# Altium schematic sheet User Interface.SchDoc
size A4; SheetNumber: 4; SheetTotal: 8
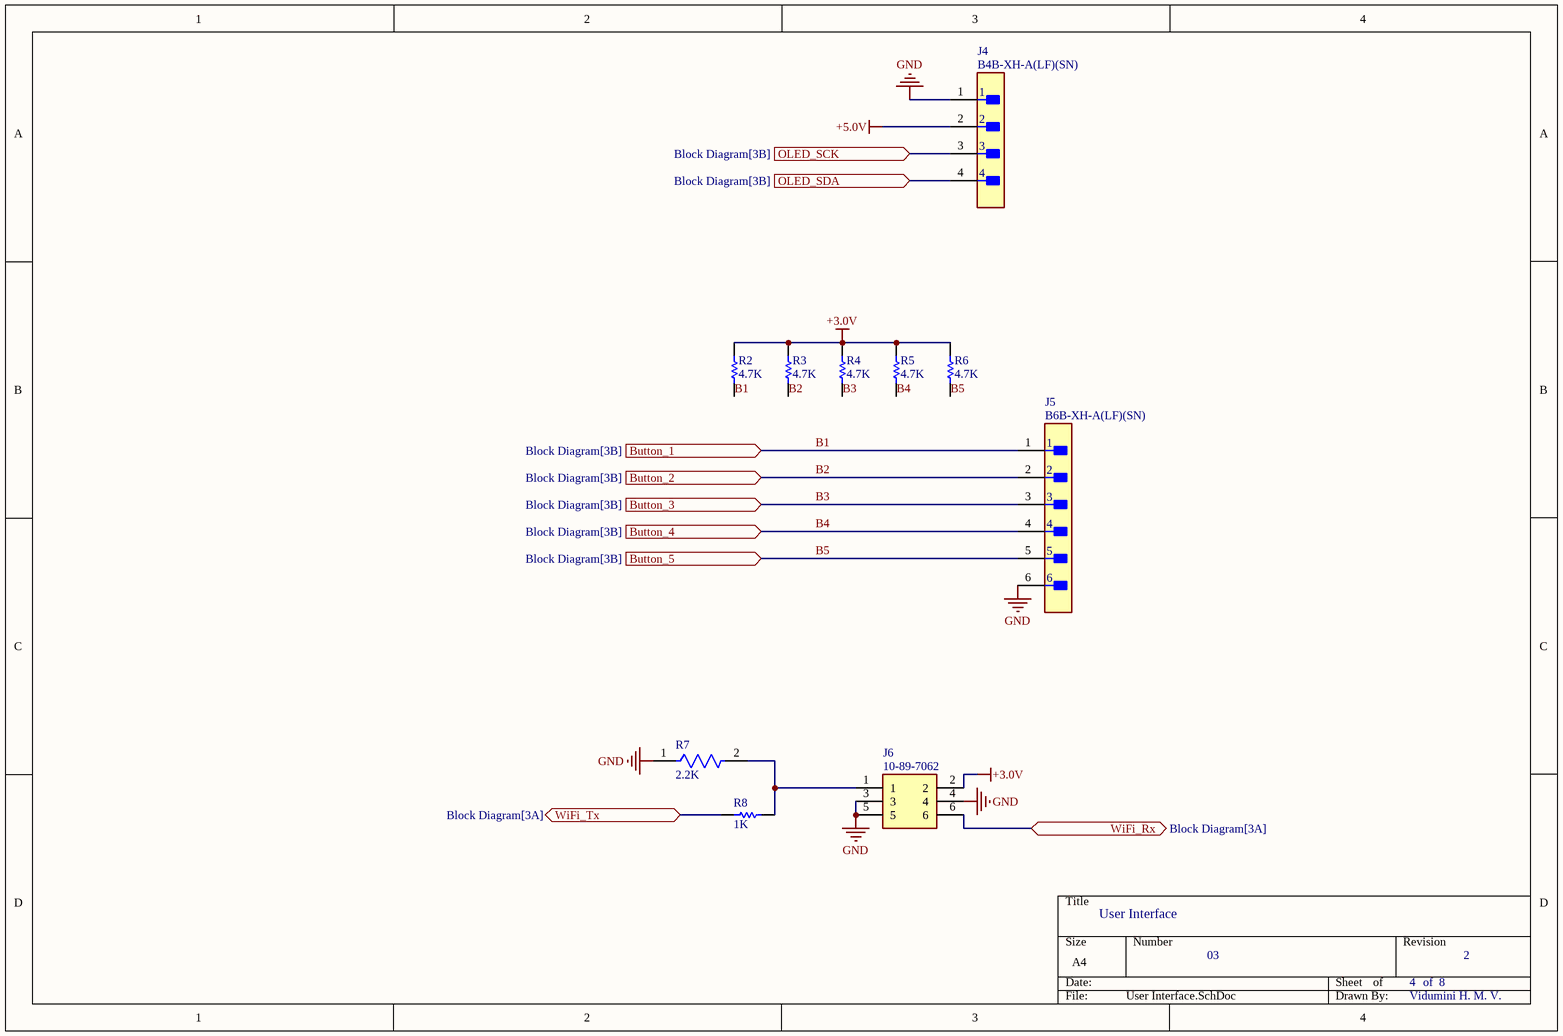
[diagram p0: User Interface.SchDoc]

## Parts
J4  B4B-XH-A(LF)(SN)  [FP-B4B-XH-A_LF_SN-MFG]
J5  B6B-XH-A(LF)(SN)  [FP-B6B-XH-A_LF_SN-MFG]
J6  10-89-7062  [HDRV6W87P254_2X3_775X508X864P]
R2  4.7K  [RESC3216X60X45ML15T20]
R3  4.7K  [RESC3216X60X45ML15T20]
R4  4.7K  [RESC3216X60X45ML15T20]
R5  4.7K  [RESC3216X60X45ML15T20]
R6  4.7K  [RESC3216X60X45ML15T20]
R7  2.2K  [FP-RT1206-MFG]
R8  1K  [RESC3116X65X40ML10T20]

## Ports
Button_1 (in, see Block Diagram[3B]), Button_2 (in, see Block Diagram[3B]), Button_3 (in, see Block Diagram[3B]), Button_4 (in, see Block Diagram[3B]), Button_5 (in, see Block Diagram[3B]), OLED_SCK (in, see Block Diagram[3B]), OLED_SDA (in, see Block Diagram[3B]), WiFi_Rx (bidir, see Block Diagram[3A]), WiFi_Tx (bidir, see Block Diagram[3A])

## Nets
+3.0V: J6.2 R2.1 R3.1 R4.1 R5.1 R6.1
+5.0V: J4.2
GND: J4.1 J5.6 J6.3 J6.4 J6.5 R7.1
B1: J5.1 R2.2 ; port Button_1
B2: J5.2 R3.2 ; port Button_2
B3: J5.3 R4.2 ; port Button_3
B4: J5.4 R5.2 ; port Button_4
B5: J5.5 R6.2 ; port Button_5
OLED_SCK: J4.3 ; port OLED_SCK
OLED_SDA: J4.4 ; port OLED_SDA
WiFi_Rx: J6.6 ; port WiFi_Rx
WiFi_Tx: R8.1 ; port WiFi_Tx
NetJ6_1: J6.1 R7.2 R8.2

## Notes on the sheet
- User Interface
- 03
- 4
- of  8
- 2
- Vidumini H. M. V.

## Library data of the parts
J4 = CMP-17439-000250-1: CONN HEADER VERT 4POS 2.5MM; Number of Contacts: 4; Contact Resistance: 20mR; Voltage Rating: 250V; Max Current Rating: 3A; Gender: Male; Wire/Cable Gauge: 22AWG; Mated Stacking Heights: 9.8mm; Insulation Resistance: 1GR; Orientation: Straight; Contact Type: Male Pin; Contact Finish - Mating: TIN; Series: XH; Max Voltage Rating (AC): 250V; Lead Pitch: 2.5mm; Contact Shape: Square; Insulation Color: Natural; Termination: Solder; Lead Free: Lead Free; Voltage Rating (AC): 250V; Number of Rows: 1; Flammability Rating: UL94 V-0; Number of Positions: 4; Max Operating Temperature: 85°C; Package Quantity: 500; Mount: Through Hole; REACH SVHC: No SVHC; Connector Type: Header; Insulation Material: Nylon; Fastening Type: Detent; Min Operating Temperature: -25°C; Housing Color: White; Packaging: Bulk; Contact Plating: Tin; Contact Material: Brass; Max Voltage Rating (DC): 250V; Housing Material: Polyamide; Color: Natural; Material: Polyamide; Pitch: 2.5mm; Depth: 5.75mm; Current Rating: 3A; Length: 12.4mm
J5 = CMP-17439-000076-1: CONN HEADER VERT 6POS 2.5MM
J6 = 10-89-7062: Connector; Manufacturer_Name: Molex; Datasheet Link: https://componentsearchengine.com/Datasheets/1/10-89-7062.pdf; Height: 8.64mm; Manufacturer_Part_Number: 10-89-7062; Mouser Part Number: 538-10-89-7062; Mouser Price/Stock: https://www.mouser.co.uk/ProductDetail/Molex/10-89-7062?qs=tRPrwvvr%2Fuh8n6rY9aRt4Q%3D%3D
R2-R6 = CMP-2100-03618-1: Chip Resistor, 4.7 KOhm, +/- 1%, 0.25 W, -55 to 155 degC, 1206 (3216 Metric), RoHS, Tape and Reel; Manufacturer: Vishay Semiconductor; Power Rating: 250mW; Voltage Rating: 200V; Temperature Coefficient: 100ppm/degreesC; Package Quantity: 10; Composition: ThickFilm; REACH SVHC: Unknown; Mount: SurfaceMount; Max Operating Temperature: 155degC; Length: 3.2mm; Number of Terminations: 2; Case Code (Metric): 3216; Military Standard: Not; Width: 1.6mm; Datasheet Version: 41061.0; Max Power Dissipation: 250mW; Datasheet URL: http://www.vishay.com/docs/20035/dcrcwe3.pdf; Contact Plating: Tin; Case/Package: 1206; Height: 0.55mm; Package Reference: 1206.0; Lead Free: LeadFree; Weight: 0.000353oz; Package Description: 2-Pin Surface Mount Device, Body 3.15 x 1.6 mm; Min Operating Temperature: -55degC; Resistance: 4.7KOhm; Packaging: TapeandReel; Depth: 1.6mm; Tolerance: 1%; RoHSCompliant: true; Termination: SMD/SMT; Case Code (Imperial): 1206; Voltage Rating (DC): 200V; Radiation Hardening: No; Manufacturer URL: http://www.vishay.com/
R7 = CMP-2003-04098-2: RES 2.20K OHM 1/4W .1% SMD 1206; Manufacturer Part Number: RT1206BRD072K2L; Manufacturer: Yageo; Tolerance: 0.005; Power Rating: 0.25W; Temperature Coefficient: 25 ppm/°C; Value: 2.2KΩ; Voltage Rating: 200V; Lead Free: Yes; ComponentLink2URL: http://www.yageo.com/documents/recent/PYu-RT_1-to-0.01_RoHS_L_9.pdf; Device Class L1: Passive Components; ComponentLink2Description: Datasheet; Series: RT; Mouser Description: Thin Film Resistors - SMD 1/4W 2.2K ohm .1% 25ppm; Digikey Description: RES 2.20K OHM 1/4W .1% SMD 1206; Composition: Thin Film; Device Class L2: Resistors; Device Class L3: Chip SMD Resistors; Octopart: https://octopart.com/rt1206brd072k2l-yageo-1194112; Package: RT1206; Height: 0.65mm; Category: Res; RoHS: TRUE; Ipc Land Pattern Name: RESC310160X55; Footprint Url: http://www.yageo.com/exep/pages/download/literatures/PYu-R_Mount_10.pdf; Temperature Range High: +155°C; Automotive: No; Temperature Range Low: -55°C; Temperature: -55°C to +155°C; Resistance: 2.2KΩ
R8 = CMP-2100-03678-1: Chip Resistor, 1 KOhm, +/- 1%, 0.25 W, -55 to 155 degC, 1206 (3216 Metric), RoHS, Tape and Reel; Manufacturer: Yageo; Temperature Coefficient: 100ppm/degreesC; Power Rating: 250mW; Voltage Rating: 200V; Resistance: 1KOhm; Composition: ThickFilm; Min Operating Temperature: -55degC; Tolerance: 1%; REACH SVHC: Unknown; Case Code (Metric): 3216; Military Standard: Not; Datasheet Version: Rev. 5, 10/2016; Package Reference: 1206.0; Case/Package: 1206; Length: 3.1mm; Manufacturer URL: http://www.yageo.com/; Lead Free: LeadFree; RoHSCompliant: true; Termination: SMD/SMT; Packaging: TapeandReel; Package Description: 2-Pin Surface Mount Device, Body 3.1 x 1.6 mm; Depth: 1.6mm; Case Code (Imperial): 1206; Max Operating Temperature: 155degC; Datasheet URL: http://www.yageo.com/NewPortal/yageodocoutput?fileName=/pdf/R-Chip/PYu-RC_Group_51_RoHS_L_5.pdf; Height: 0.55mm